# Altium schematic sheet Torques.SchDoc
size Letter; DocumentNumber: 5; SheetNumber: 5; SheetTotal: 11; Pagesize: Letter
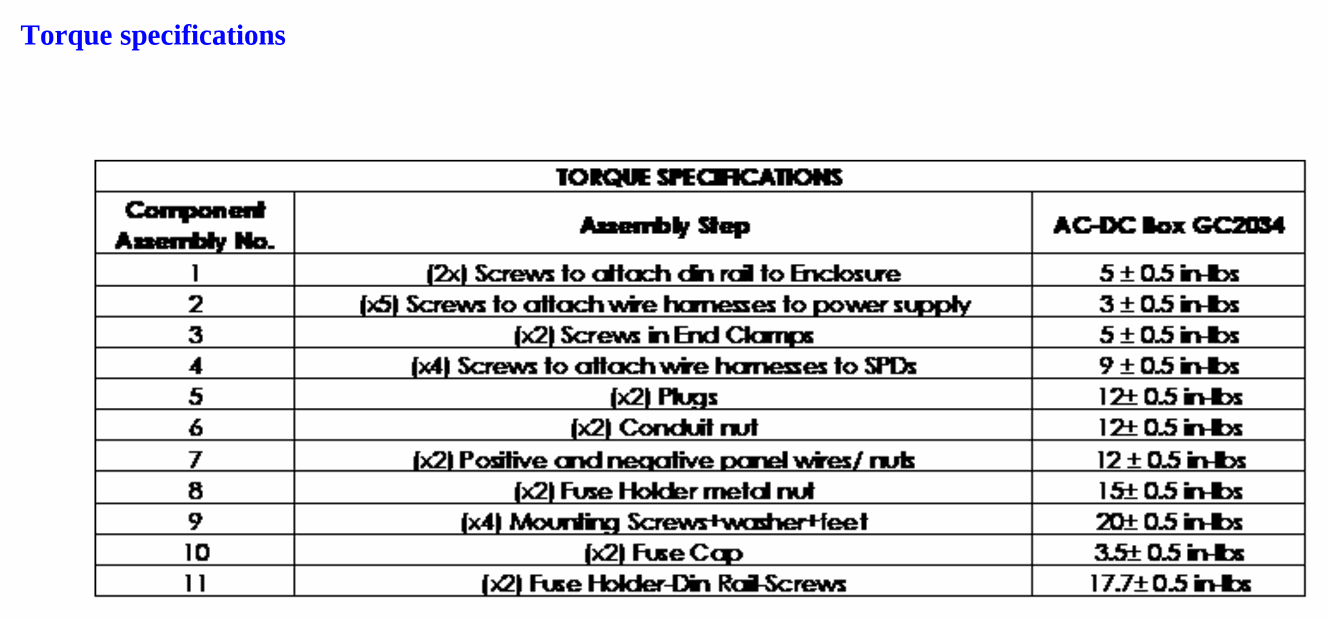
[diagram p0: Torques.SchDoc]

## Notes on the sheet
- Torque specifications
- ---UNLESS OTHERWISE NOTED ---
  1. All resistors and capacitors are 0603 package.
  2. All resistor tolerances are 1%.
- Design
- Size
- Date
- Page
- Revision
- Time
- Sheet
- Author
- of
- File